# EAGLE schematic Stepper Motor Driver v1.0 (EAGLE 6.3)
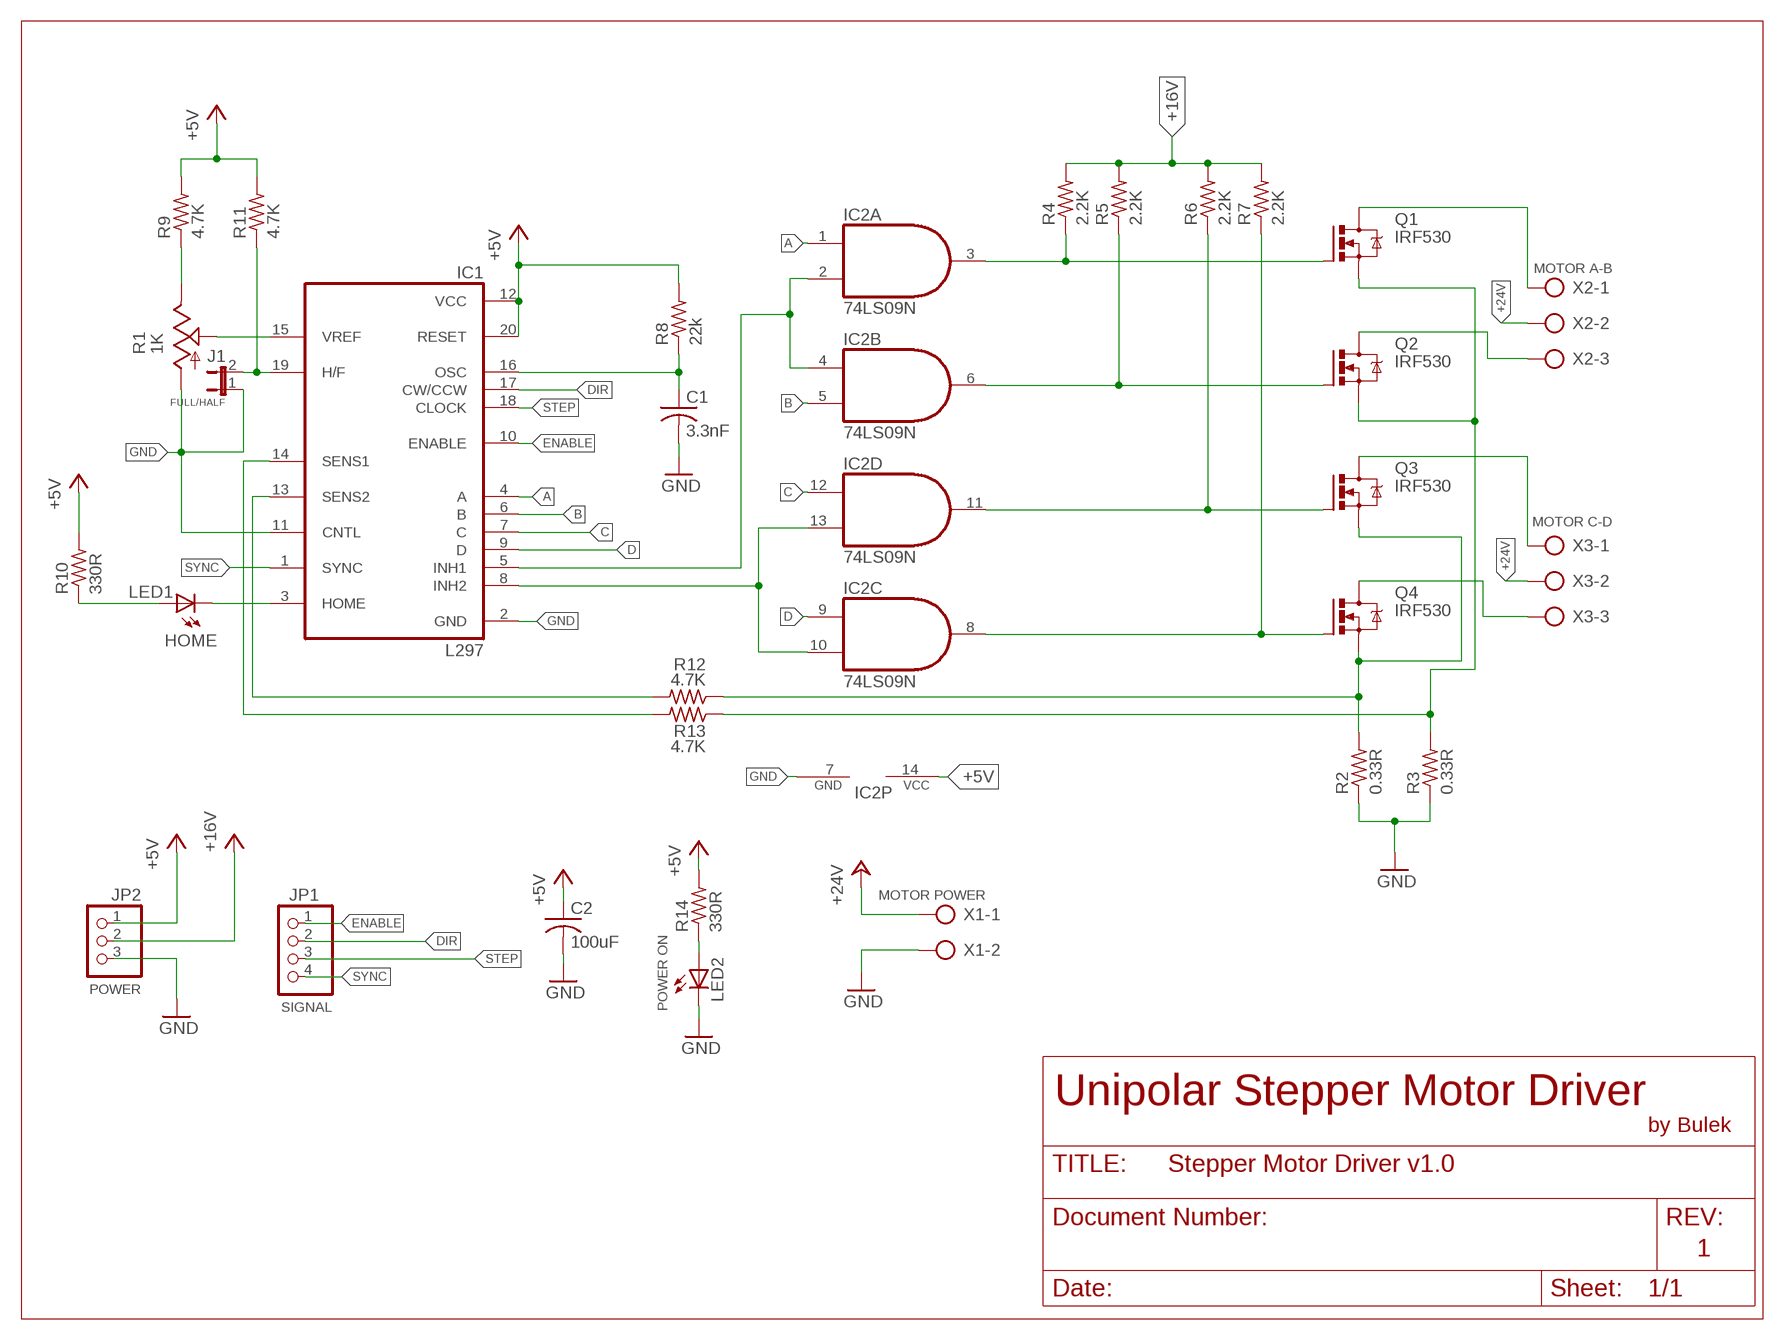
[diagram p0: schematic, sheet 1]

## Parts
C1  3.3nF  C-US025-024X044  [C025-024X044]
C2  100uF  C-US025-024X044  [C025-024X044]
FULL/HALF  J1  JP1E  [JP1]
IC1  L297  [DIL20]
IC2  74LS09N  [DIL14]
JP1  SIGNAL  PINHD-1X4  [1X04]
JP2  POWER  PINHD-1X3/90  [1X03/90]
LED1  HOME  LED5MM  [LED5MM]
LED2  POWER ON  LED5MM  [LED5MM]
Q1  IRF530  [TO220BV]
Q2  IRF530  [TO220BV]
Q3  IRF530  [TO220BV]
Q4  IRF530  [TO220BV]
R1  1K  TRIM_US-S63X  [S63X]
R2  0.33R  R-US_0617/22  [0617/22]
R3  0.33R  R-US_0617/22  [0617/22]
R4  2.2K  R-US_0207/10  [0207/10]
R5  2.2K  R-US_0207/10  [0207/10]
R6  2.2K  R-US_0207/10  [0207/10]
R7  2.2K  R-US_0207/10  [0207/10]
R8  22k  R-US_0207/10  [0207/10]
R9  4.7K  R-US_0207/10  [0207/10]
R10  330R  R-US_0207/10  [0207/10]
R11  4.7K  R-US_0207/10  [0207/10]
R12  4.7K  R-US_0207/10  [0207/10]
R13  4.7K  R-US_0207/10  [0207/10]
R14  330R  R-US_0207/10  [0207/10]
X1  MOTOR POWER  AK300/2  [AK300/2]
X2  MOTOR A-B  AK300/3  [AK300/3]
X3  MOTOR C-D  AK300/3  [AK300/3]

## Nets
+5V: C2.1 IC1.12(VCC) IC1.20(RESET) IC2.14(P:VCC) JP2.1 R8.2 R9.2 R10.2 R11.2 R14.2
+16V: JP2.2 R4.2 R5.2 R6.2 R7.2
+24V [POWER]: X1.1 X2.2 X3.2
A: IC1.4(A) IC2.1(A:I0)
B: IC1.6(B) IC2.5(B:I1)
C: IC1.7(C) IC2.12(D:I0)
D: IC1.9(D) IC2.9(C:I0)
DIR: IC1.17(CW/CCW) JP1.2
ENABLE: IC1.10(ENABLE) JP1.1
GND [GND]: C1.2 C2.2 FULL/HALF.1 IC1.2(GND) IC1.11(CNTL) IC2.7(P:GND) JP2.3 LED2.K(C) R1.A R2.1 R3.1 X1.2
INH1: IC1.5(INH1) IC2.2(A:I1) IC2.4(B:I0)
INH2: IC1.8(INH2) IC2.10(C:I1) IC2.13(D:I1)
N$1: R1.E R9.1
N$2: IC1.15(VREF) R1.S
N$3: C1.1 IC1.16(OSC) R8.1
N$4: IC1.3(HOME) LED1.K(C)
N$5: LED1.A R10.1
N$6: FULL/HALF.2 IC1.19(H/F) R11.1
N$7: IC1.14(SENS1) R13.2
N$8: IC1.13(SENS2) R12.2
N$9: IC2.3(A:O) Q1.G R4.1
N$10: IC2.6(B:O) Q2.G R5.1
N$11: IC2.11(D:O) Q3.G R6.1
N$12: IC2.8(C:O) Q4.G R7.1
N$13 [POWER]: Q1.S Q2.S R3.2 R13.1
N$14 [POWER]: Q3.S Q4.S R2.2 R12.1
N$15 [POWER]: Q1.D X2.1
N$16 [POWER]: Q2.D X2.3
N$17 [POWER]: Q3.D X3.1
N$18 [POWER]: Q4.D X3.3
N$20: LED2.A R14.1
STEP: IC1.18(CLOCK) JP1.3
SYNC: IC1.1(SYNC)
Unconnected: JP1.4

## Notes on the sheet
- Unipolar Stepper Motor Driver
- by Bulek
- 1

## Library data of the parts
C1 C2 = rcl:C-US: CAPACITOR, American symbol
FULL/HALF = jumper:JP1E: JUMPER
IC1 = st-microelectronics:L297: STEPPER MOTOR CONTROLLER; MPN: L297/1; OC_FARNELL: 1094209; OC_NEWARK: 56P8258
IC2 = 74xx-us:74*09: Quad 2-input AND gate, open collector
JP1 = pinhead:PINHD-1X4: PIN HEADER
JP2 = pinhead:PINHD-1X3: PIN HEADER
LED1 LED2 = led:LED: LED OSRAM: - CHIPLED LG R971, LG N971, LY N971, LG Q971, LY Q971, LO R971, LY R971 LH N974, LH R974 LS Q976, LO Q976, LY Q976 LO Q996 - Hyper CHIPLED LW Q18S LB Q993, LB Q99A, LB R99A - SideLED LS A670, LO A670, LY A670, LG A670, LP A670 LB A673, LV A673, LT A673, LW A673 LH A674 LY A675 LS A676, LA A676, LO A676, LY A676, LW A676 LS A679, LY A679, LG A679 - Hyper Micro SIDELED® LS Y876, LA Y876, LO Y876, LY Y876 LT Y87S - SmartLED LW L88C, LW L88S LB L89C, LB L89S, LG L890 LS L89K, LO L89K, LY L89K LS L896, LA L896, LO L896, LY L896 - TOPLED LS T670, LO T670, LY T670, LG T670, LP T670 LSG T670, LSP T670, LSY T670, LOP T670, LYG T670 LG T671, LOG T671, LSG T671 LB T673, LV T673, LT T673, LW T673 LH T674 LS T676, LA T676, LO T676, LY T676, LB T676, LH T676, LSB T676, LW T676 LB T67C, LV T67C, LT T67C, LS T67K, LO T67K, LY T67K, LW E67C LS E67B, LA E67B, LO E67B, LY E67B, LB E67C, LV E67C, LT E67C LW T67C LS T679, LY T679, LG T679 LS T770, LO T770, LY T770, LG T770, LP T770 LB T773, LV T773, LT T773, LW T773 LH T774 LS E675, LA E675, LY E675, LS T675 LS T776, LA T776, LO T776, LY T776, LB T776 LHGB T686 LT T68C, LB T68C - Hyper Mini TOPLED® LB M676 - Mini TOPLED Santana® LG M470 LS M47K, LO M47K, LY M47K Source: http://www.osram.convergy.de LUXEON: - LUMILED® LXK2-PW12-R00, LXK2-PW12-S00, LXK2-PW14-U00, LXK2-PW14-V00 LXK2-PM12-R00, LXK2-PM12-S00, LXK2-PM14-U00 LXK2-PE12-Q00, LXK2-PE12-R00, LXK2-PE12-S00, LXK2-PE14-T00, LXK2-PE14-U00 LXK2-PB12-K00, LXK2-PB12-L00, LXK2-PB12-M00, LXK2-PB14-N00, LXK2-PB14-P00, LXK2-PB14-Q00 LXK2-PR12-L00, LXK2-PR12-M00, LXK2-PR14-Q00, LXK2-PR14-R00 LXK2-PD12-Q00, LXK2-PD12-R00, LXK2-PD12-S00 LXK2-PH12-R00, LXK2-PH12-S00 LXK2-PL12-P00, LXK2-PL12-Q00, LXK2-PL12-R00 Source: www.luxeon.com KINGBRIGHT: KA-3528ASYC Source: www.kingbright.com
Q1-Q4 = transistor-power:IRF530: HEXFET Power MOSFET
R1 = pot:TRIM_US-: POTENTIOMETER
R2-R14 = resistor:R-US_: RESISTOR, American symbol
X1 = con-ptr500:AK300/2: CONNECTOR; OC_FARNELL: unknown; OC_NEWARK: unknown
X2 X3 = con-ptr500:AK300/3: CONNECTOR; OC_FARNELL: unknown; OC_NEWARK: unknown

## Net classes
0 default: width 1.219 mm
1 GND: width 1.626 mm
2 POWER: width 1.626 mm